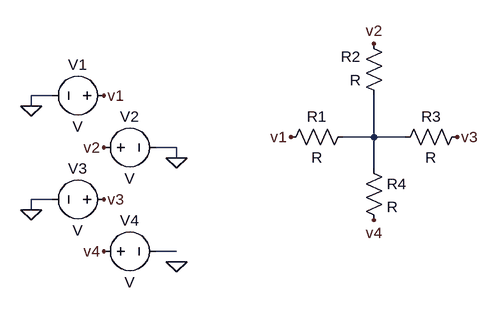
[diagram p0: schematic Q1 blank.asc]
Q1 blank.asc, the LTspice schematic file:
Version 4.1
SHEET 1 880 680
WIRE -352 112 -384 112
WIRE -384 128 -384 112
WIRE 144 176 144 112
WIRE 144 176 96 176
WIRE 192 176 144 176
WIRE -160 192 -192 192
WIRE -160 208 -160 192
WIRE 144 224 144 176
WIRE -352 272 -384 272
WIRE -384 288 -384 272
WIRE -160 352 -192 352
FLAG 16 176 v1
FLAG 144 32 v2
FLAG 272 176 v3
FLAG 144 304 v4
FLAG -272 112 v1
FLAG -272 192 v2
FLAG -272 272 v3
FLAG -272 352 v4
FLAG -160 368 0
FLAG -384 288 0
FLAG -160 208 0
FLAG -384 128 0
SYMBOL res 112 160 R90
WINDOW 0 0 56 VBottom 2
WINDOW 3 32 56 VTop 2
SYMATTR InstName R1
SYMBOL res 160 128 R180
WINDOW 0 36 76 Left 2
WINDOW 3 36 40 Left 2
SYMATTR InstName R2
SYMBOL res 176 192 R270
WINDOW 0 32 56 VTop 2
WINDOW 3 0 56 VBottom 2
SYMATTR InstName R3
SYMBOL res 128 208 R0
SYMATTR InstName R4
SYMBOL voltage -256 112 R90
WINDOW 0 -32 56 VBottom 2
WINDOW 3 32 56 VTop 2
SYMATTR InstName V1
SYMBOL voltage -288 192 R270
WINDOW 0 32 56 VTop 2
WINDOW 3 -32 56 VBottom 2
SYMATTR InstName V2
SYMBOL voltage -256 272 R90
WINDOW 0 -32 56 VBottom 2
WINDOW 3 32 56 VTop 2
SYMATTR InstName V3
SYMBOL voltage -288 352 R270
WINDOW 0 32 56 VTop 2
WINDOW 3 -32 56 VBottom 2
SYMATTR InstName V4

The netlist it stands for:
* Q1 blank.asc
R1 N001 v1 R
R2 N001 v2 R
R3 N001 v3 R
R4 N001 v4 R
V1 v1 0 V
V2 v2 0 V
V3 v3 0 V
V4 v4 N002 V
.backanno
.end